# EAGLE design FonteTensaoVariavel (EAGLE 9.6.2)
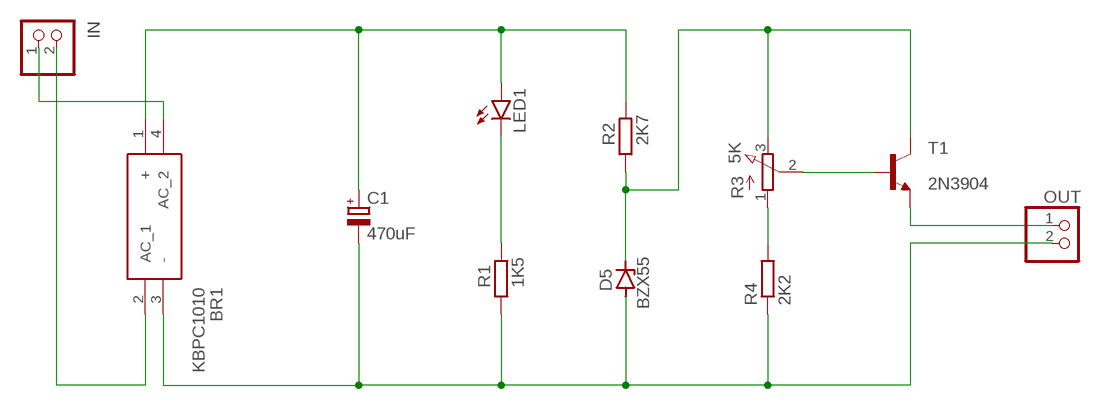
[diagram p0: schematic, sheet 1]

## Parts
BR1  KBPC1010  [KBPC1010]
C1  470uF  CPOL-EUE5-10.5  [E5-10,5]
D5  BZX55  [DO35Z10]
IN  PINHD-1X2  [1X02]
LED1  LED5MM  [LED5MM]
OUT  PINHD-1X2  [1X02]
R1  1K5  R-EU_0207/10  [0207/10]
R2  2K7  R-EU_0207/10  [0207/10]
R3  5K  3RP/1610N  [3RP/1610N]
R4  2K2  R-EU_0207/10  [0207/10]
T1  2N3904  [TO92]

## Nets
N$1: BR1.4(AC_2) IN.1
N$2: BR1.3(-) C1.- D5.A OUT.2 R1.1 R4.1
N$3: BR1.2(AC_1) IN.2
N$4: BR1.1(+) C1.+ LED1.A R2.2
N$5: LED1.K(C) R1.2
N$6: D5.C R2.1 R3.3(E) T1.1(C)
N$7: OUT.1 T1.3(E)
N$8: R3.1(A) R4.2
N$10: R3.2(S) T1.2(B)

## Library data of the parts
BR1 = SamacSys_Parts:KBPC1010: Bridge Rectifiers KBPC-6 Source: Datasheet <https://datasheet.lcsc.com/szlcsc/1903051202_MDD-Jiangsu-Yutai-Elec-KBPC1010_C3082.pdf>; ARROW_PART_NUMBER: KBPC1010; DESCRIPTION: Bridge Rectifiers KBPC-6; HEIGHT: 5.4mm; MANUFACTURER_NAME: MDD&pound;&uml;Microdiode Electronics&pound;&copy;; MANUFACTURER_PART_NUMBER: KBPC1010
C1 = rcl:CPOL-EU: POLARIZED CAPACITOR, European symbol; SPICEPREFIX: C
D5 = diode:BZX55: Z DIODE
IN OUT = pinhead:PINHD-1X2: PIN HEADER
LED1 = led:LED: LED OSRAM: - CHIPLED LG R971, LG N971, LY N971, LG Q971, LY Q971, LO R971, LY R971 LH N974, LH R974 LS Q976, LO Q976, LY Q976 LO Q996 - Hyper CHIPLED LW Q18S LB Q993, LB Q99A, LB R99A - SideLED LS A670, LO A670, LY A670, LG A670, LP A670 LB A673, LV A673, LT A673, LW A673 LH A674 LY A675 LS A676, LA A676, LO A676, LY A676, LW A676 LS A679, LY A679, LG A679 - Hyper Micro SIDELED® LS Y876, LA Y876, LO Y876, LY Y876 LT Y87S - SmartLED LW L88C, LW L88S LB L89C, LB L89S, LG L890 LS L89K, LO L89K, LY L89K LS L896, LA L896, LO L896, LY L896 - TOPLED LS T670, LO T670, LY T670, LG T670, LP T670 LSG T670, LSP T670, LSY T670, LOP T670, LYG T670 LG T671, LOG T671, LSG T671 LB T673, LV T673, LT T673, LW T673 LH T674 LS T676, LA T676, LO T676, LY T676, LB T676, LH T676, LSB T676, LW T676 LB T67C, LV T67C, LT T67C, LS T67K, LO T67K, LY T67K, LW E67C LS E67B, LA E67B, LO E67B, LY E67B, LB E67C, LV E67C, LT E67C LW T67C LS T679, LY T679, LG T679 LS T770, LO T770, LY T770, LG T770, LP T770 LB T773, LV T773, LT T773, LW T773 LH T774 LS E675, LA E675, LY E675, LS T675 LS T776, LA T776, LO T776, LY T776, LB T776 LHGB T686 LT T68C, LB T68C - Hyper Mini TOPLED® LB M676 - Mini TOPLED Santana® LG M470 LS M47K, LO M47K, LY M47K Source: http://www.osram.convergy.de LUXEON: - LUMILED® LXK2-PW12-R00, LXK2-PW12-S00, LXK2-PW14-U00, LXK2-PW14-V00 LXK2-PM12-R00, LXK2-PM12-S00, LXK2-PM14-U00 LXK2-PE12-Q00, LXK2-PE12-R00, LXK2-PE12-S00, LXK2-PE14-T00, LXK2-PE14-U00 LXK2-PB12-K00, LXK2-PB12-L00, LXK2-PB12-M00, LXK2-PB14-N00, LXK2-PB14-P00, LXK2-PB14-Q00 LXK2-PR12-L00, LXK2-PR12-M00, LXK2-PR14-Q00, LXK2-PR14-R00 LXK2-PD12-Q00, LXK2-PD12-R00, LXK2-PD12-S00 LXK2-PH12-R00, LXK2-PH12-S00 LXK2-PL12-P00, LXK2-PL12-Q00, LXK2-PL12-R00 Source: www.luxeon.com KINGBRIGHT: KA-3528ASYC Source: www.kingbright.com
R1 R2 R4 = rcl:R-EU_: RESISTOR, European symbol; SPICEPREFIX: R
R3 = pot:3RP/1610N: 16mm Potentiometer one level Source: http://www.alphapotentiometers.net/html/16mm_pot_2.html
T1 = transistor:2N3904: NPN TRANSISTOR

## Board
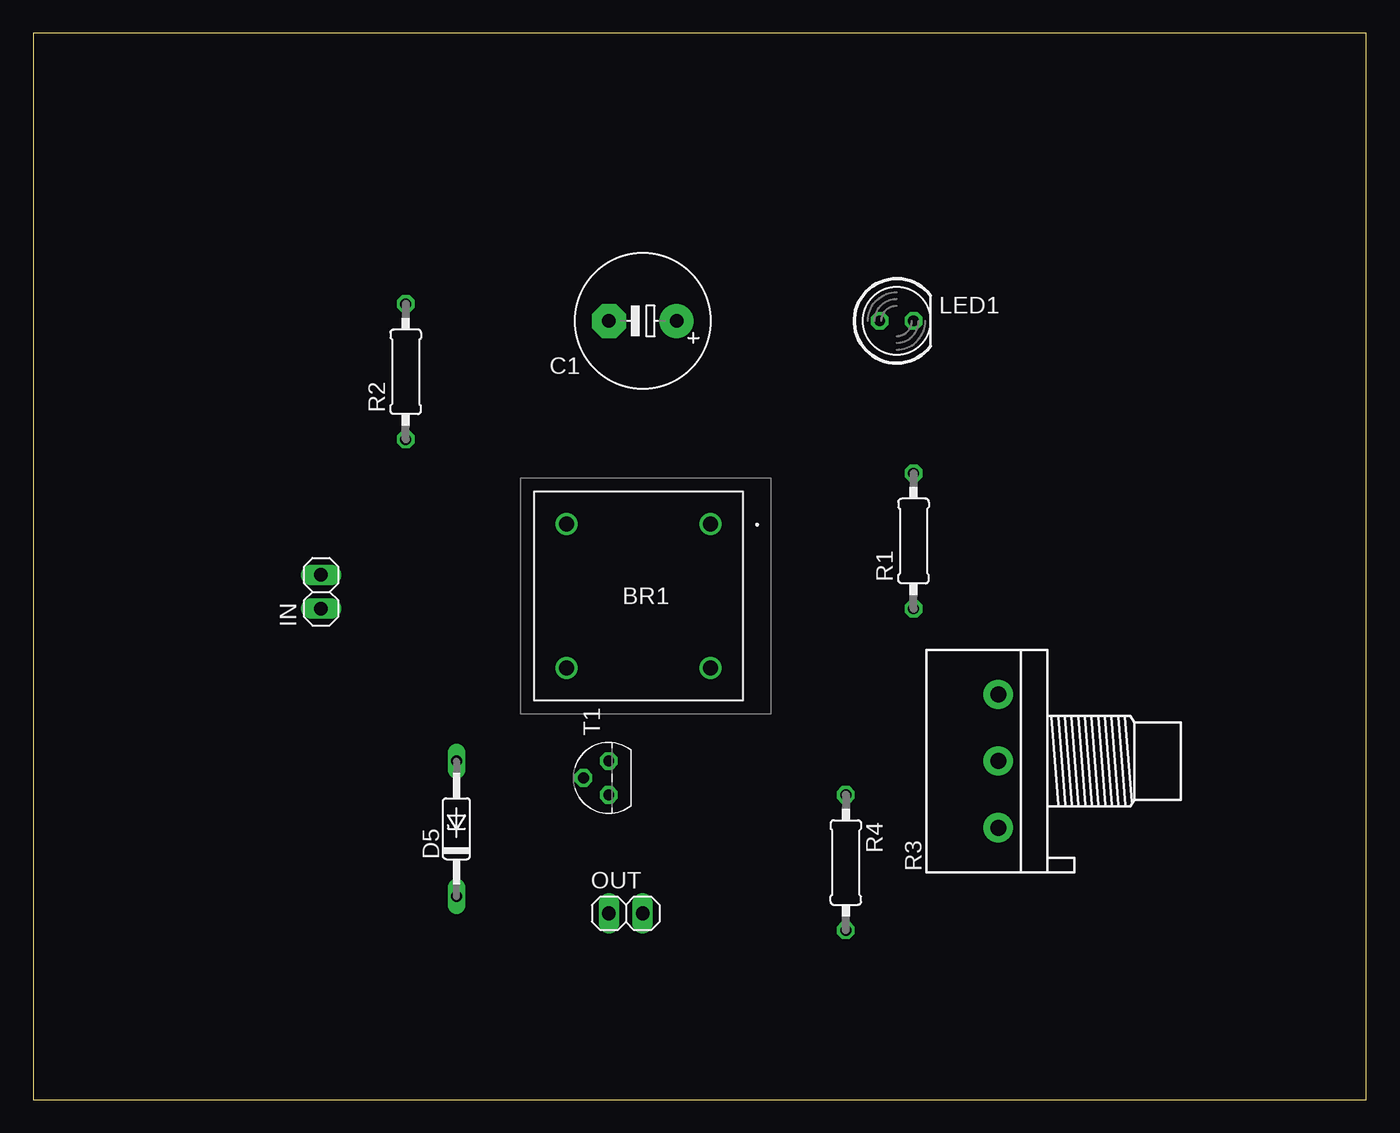
[diagram p1: board, top side]
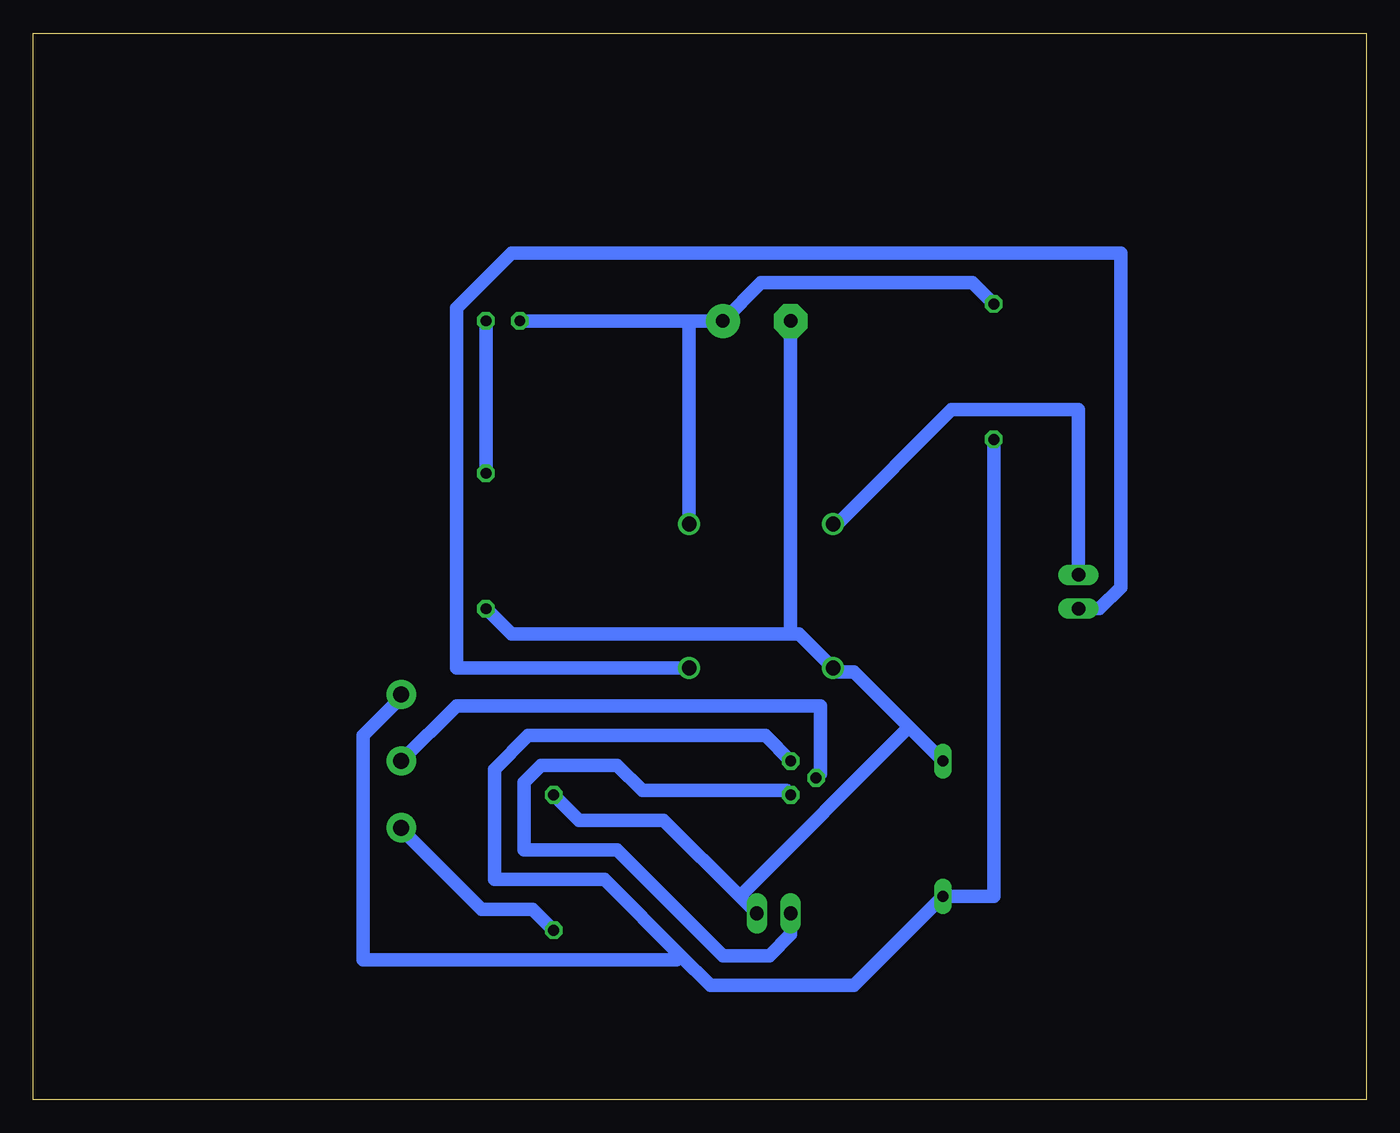
[diagram p2: board, bottom side, seen from below]

Size 100 x 80 mm. Coordinates in mm from the lower left corner, seen from the top.
Outline: 0,0 100,0 100,80 0,80 0,0
Copper layers (1*16): Top 0.035mm / dielectric 1.5mm / Bottom 0.035mm
Design rules "default *": minimum track width 40mil, minimum drill 0.35mm, track to track 40mil, track to pad 40mil, pad to pad 40mil, via to via 40mil, smd to smd 6mil, copper to edge 40mil, drill to drill 6mil, minimum pad ring 10mil, minimum via ring 8mil, stop-mask expansion 4mil, vias tented up to drill 0mil, thermal gap 10mil

### Footprints (pad centres in the part's own frame; a part is rotated, then mirrored left to right if it is on the bottom)
KBPC1010 = drill 1.1 pad 1.65: 1 0,0; 2 10.8,0; 3 10.8,10.8; 4 0,10.8
E5-10,5 = drill 1.016 pad 2.54: + -2.54,0 | drill 1.016 pad 2.54 octagon: - 2.54,0
DO35Z10 = drill 0.813 long: A 5.08,0; C -5.08,0
1X02 = drill 1.016 long: 1 -1.27,0; 2 1.27,0
LED5MM = drill 0.813 octagon: A -1.27,0; K 1.27,0
0207/10 = drill 0.813 octagon: 1 -5.08,0; 2 5.08,0
3RP/1610N = drill 1.2 pad 2.184: 1 -5,0; 2 0,0; 3 5,0
TO92 = drill 0.813 octagon: 1 1.27,0; 2 0,1.905; 3 -1.27,0

### Placement (x,y rotation side)
BR1  50.8,43.18 180 top
C1  45.72,58.42 180 top
D5  31.75,20.32 90 top
IN  21.59,38.1 90 top
LED1  64.77,58.42 0 top
OUT  44.45,13.97 0 top
R1  66.04,41.91 90 top
R2  27.94,54.61 90 top
R3  72.39,25.4 90 top
R4  60.96,17.78 270 top
T1  43.18,24.13 90 top

### Tracks (layer width: path | path; a pad name or v marks a point on that pad's centre or on a via)
N$1
  Bottom 1.016: IN.1 20,36.83 18.41,38.42 18.41,63.5 64.14,63.5 68.26,59.37 68.26,32.38 BR1.4
N$2
  Bottom 1.016: R4.1 59.05,20.95 52.7,20.95 46.99,15.24 | OUT.2 46.99,15.24 | 34.29,27.94 38.42,32.07 39.69,32.07 BR1.3 42.55,34.92 43.18,34.92 | 34.29,27.94 D5.A | R1.1 64.14,34.92 43.18,34.92 | 43.18,34.92 C1.- | 34.29,27.94 46.99,15.24
N$3
  Bottom 1.016: IN.2 21.59,51.75 31.11,51.75 39.69,43.18 BR1.2
N$4
  Bottom 1.016: 50.8,58.42 C1.+ 45.4,61.28 29.53,61.28 R2.2 | 50.8,58.42 LED1.A | 50.8,58.42 BR1.1
N$5
  Bottom 1.016: LED1.K R1.2
N$6
  Bottom 1.016: R2.1 27.94,15.24 D5.C 38.42,8.57 49.21,8.57 51.44,10.79 | T1.1 45.09,27.3 62.87,27.3 65.41,24.77 65.41,16.51 57.15,16.51 51.44,10.79 | R3.3 72.39,30.16 75.25,27.3 75.25,10.48 51.75,10.48 51.44,10.79
N$7
  Bottom 1.016: T1.3 43.5,23.18 54.29,23.18 56.2,25.08 61.91,25.08 63.18,23.81 63.18,18.73 56.2,18.73 48.26,10.79 44.77,10.79 43.18,12.38 OUT.1
N$8
  Bottom 1.016: R4.2 62.55,14.29 66.36,14.29 72.39,20.32 R3.1
N$10
  Bottom 1.016: T1.2 40.96,24.45 40.96,29.53 68.26,29.53 R3.2